# Altium schematic sheet Flomio BLE-NFC - RFID.SchDoc: Flomio BLE-NFC::RFID
size Tabloid; Author: Alex J. Tucker; CompanyName: Anidea Engineering, Inc.; DrawnBy: Alex J. Tucker; Engineer: Alex J. Tucker; Organization: Anidea Engineering, Inc.; Address1: 8020 Belvedere Rd.; Address2: Ste #1; Address3: West Palm Beach, FL; Address4: 33411    USA; DocumentNumber: 3; Revision: 3; SheetNumber: 3; SheetTotal: 5
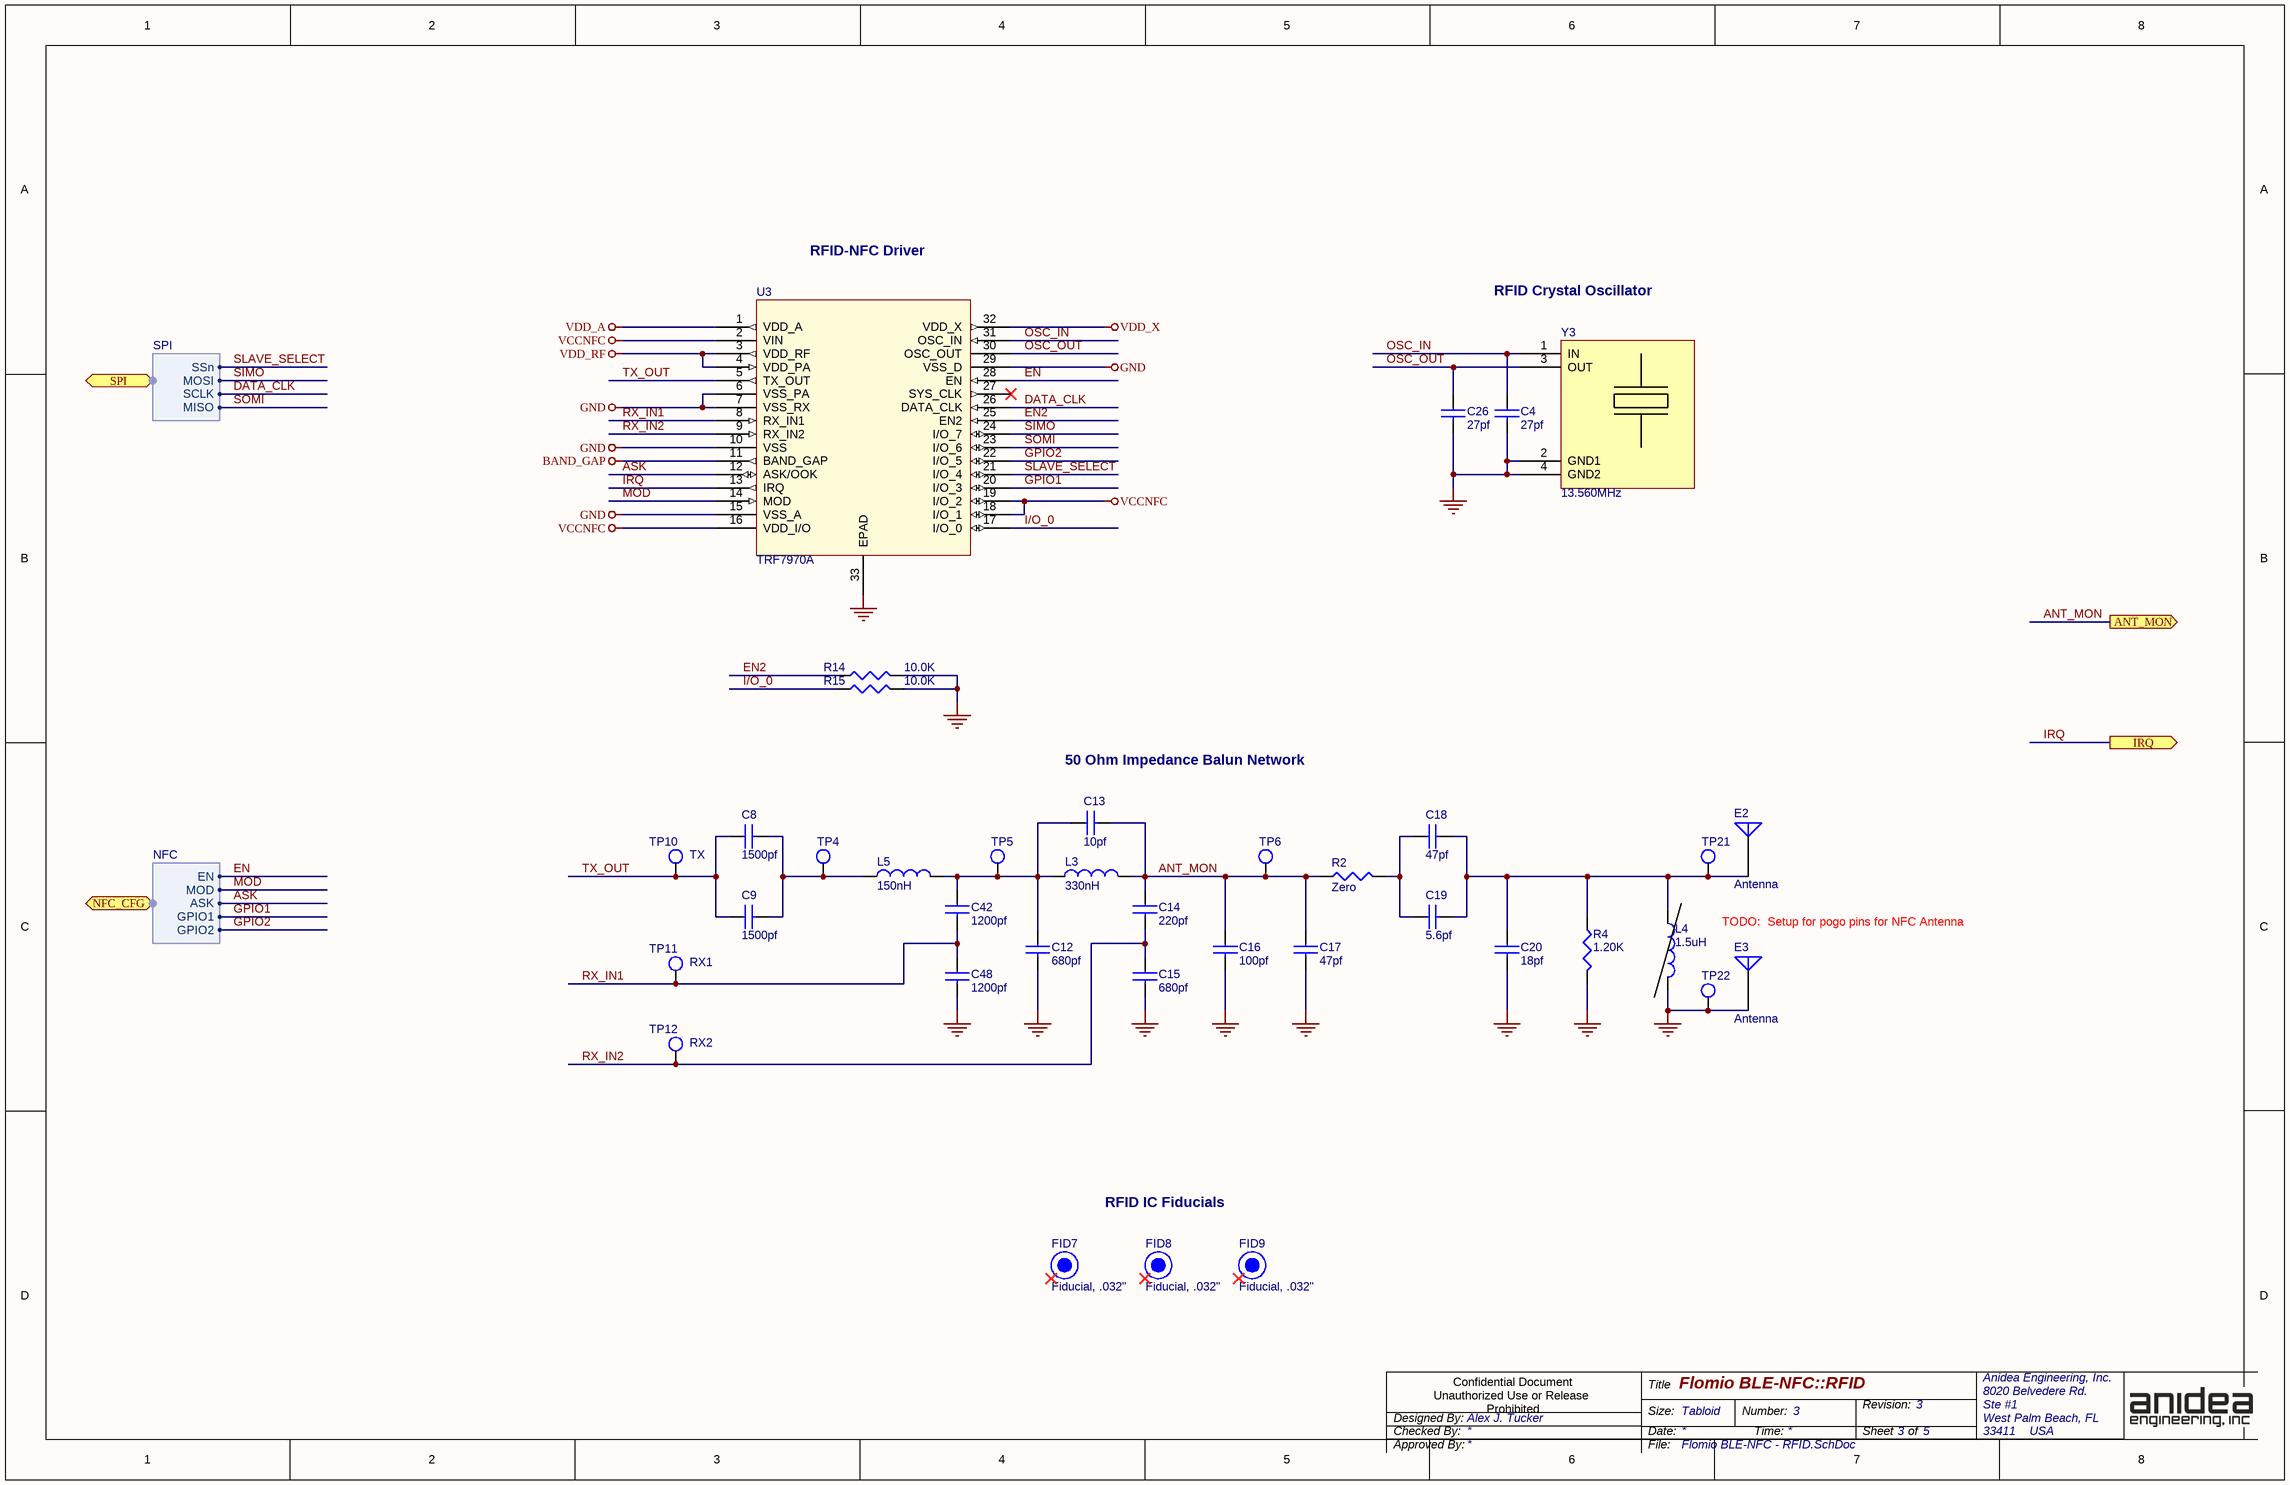
[diagram p0: Flomio BLE-NFC - RFID.SchDoc]

## Parts
C4  27pf  [SM/C_0603]
C8  1500pf  [SM/C_0603]
C9  1500pf  [SM/C_0603]
C12  680pf  [SM/C_0603]
C13  10pf  [SM/C_0603]
C14  220pf  [SM/C_0603]
C15  680pf  [SM/C_0603]
C16  100pf  [SM/C_0603]
C17  47pf  [SM/C_0603]
C18  47pf  [SM/C_0603]
C19  5.6pf  [SM/C_0603]
C20  18pf  [SM/C_0603]
C26  27pf  [SM/C_0603]
C42  1200pf  [SM/C_0603]
C48  1200pf  [SM/C_0603]
E2  Antenna  [CST/FLOMIO/ANT]
E3  Antenna  [CST/FLOMIO/ANT]
FID7  Fiducial, .032"  [FID32]  (no BOM)
FID8  Fiducial, .032"  [FID32]  (no BOM)
FID9  Fiducial, .032"  [FID32]  (no BOM)
L3  330nH  [SM/I_1008]
L4  1.5uH  [SM/I_0603]
L5  150nH  [SM/I_1008]
R2  Zero  [SM/R_0603]
R4  1.20K  [SM/R_0603]
R14  10.0K  [SM/R_0603]
R15  10.0K  [SM/R_0603]
TP4  TP  [VIA18]  (value not drawn)  (no BOM)
TP5  TP  [VIA18]  (value not drawn)  (no BOM)
TP6  TP  [VIA18]  (value not drawn)  (no BOM)
TP10  TX  [VIA18]  (no BOM)
TP11  RX1  [VIA18]  (no BOM)
TP12  RX2  [VIA18]  (no BOM)
TP21  TP  [VIA28]  (value not drawn)  (no BOM)
TP22  TP  [VIA28]  (value not drawn)  (no BOM)
U3  TRF7970A  [QFN50P500X500X100-32N]
Y3  13.560MHz  [CRYSTAL/ABM8G]

## Ports
ANT_MON (out), IRQ (out), NFC_CFG (harness NFC), SPI (harness SPI)

## Harnesses
SPI: SSn, MOSI, SCLK, MISO
NFC: EN, MOD, ASK, GPIO1, GPIO2

## Nets
BAND_GAP: U3.11(BAND_GAP)
GND: C4.2 C12.2 C15.2 C16.2 C17.2 C20.2 C26.2 C48.2 E3.1 L4.2 R4.2 R14.2 R15.2 TP22.1(TP) U3.6(VSS_PA) U3.7(VSS_RX) U3.10(VSS) U3.15(VSS_A) U3.29(VSS_D) U3.33(EPAD) Y3.2(GND1) Y3.4(GND2)
VCCNFC: U3.2(VIN) U3.16(VDD_I/O) U3.18(I/O_1) U3.19(I/O_2)
VDD_A: U3.1(VDD_A)
VDD_RF: U3.3(VDD_RF) U3.4(VDD_PA)
VDD_X: U3.32(VDD_X)
ANT_MON: C13.2 C14.1 C16.1 C17.1 L3.2 R2.1 TP6.1(TP) ; port ANT_MON
ASK: U3.12(ASK/OOK) ; port NFC_CFG.ASK
DATA_CLK: U3.26(DATA_CLK) ; port SPI.SCLK
EN: U3.28(EN) ; port NFC_CFG.EN
EN2: R14.1 U3.25(EN2)
GPIO1: U3.20(I/O_3) ; port NFC_CFG.GPIO1
GPIO2: U3.22(I/O_5) ; port NFC_CFG.GPIO2
I/O_0: R15.1 U3.17(I/O_0)
IRQ: U3.13(IRQ) ; port IRQ
MOD: U3.14(MOD) ; port NFC_CFG.MOD
OSC_IN: C4.1 U3.31(OSC_IN) Y3.1(IN)
OSC_OUT: C26.1 U3.30(OSC_OUT) Y3.3(OUT)
RX_IN1: C42.2 C48.1 TP11.1(TP) U3.8(RX_IN1)
RX_IN2: C14.2 C15.1 TP12.1(TP) U3.9(RX_IN2)
SIMO: U3.24(I/O_7) ; port SPI.MOSI
SLAVE_SELECT: U3.21(I/O_4) ; port SPI.SSn
SOMI: U3.23(I/O_6) ; port SPI.MISO
TX_OUT: C8.1 C9.1 TP10.1(TP) U3.5(TX_OUT)
NetC8_2: C8.2 C9.2 L5.1 TP4.1(TP)
NetC12_1: C12.1 C13.1 C42.1 L3.1 L5.2 TP5.1(TP)
NetC18_1: C18.1 C19.1 R2.2
NetC18_2: C18.2 C19.2 C20.1 E2.1 L4.1 R4.1 TP21.1(TP)

Not connected (* = marked no-connect by the designer): FID7 1*; FID8 1*; FID9 1*; U3 27(SYS_CLK)*

## Notes on the sheet
- RFID-NFC Driver
- RFID Crystal Oscillator
- 50 Ohm Impedance Balun Network
- TODO:  Setup for pogo pins for NFC Antenna
- RFID IC Fiducials
- Confidential Document
  Unauthorized Use or Release
  Prohibited
- Checked By:
- Designed By:
- Title
- Size:
- Date:
- Tabloid
- Number:
- Time:
- Revision:
- Sheet
- of
- Approved By:
- File:

## Library data of the parts
C4 C26 = C0603C270J5GACTU: Cap, 0603, 27pf , 50V, 5%, C0G, NP0; Mfg: Kemet; Part Number: C0603C270J5GACTU; Tolerance: 5%; Voltage: 50V; Mfg Part Number: C0603C270J5GACTU; ComponentLink1Description: Local; ComponentLink1URL: \\brak\public\pdf\Kemet Ceramic C0G.pdf; ComponentLink2Description: Web; Supplier Part Number 1: 399-1054-1-ND; Supplier 1: Digi-Key; RoHS: True; Rating: C0G, NP0; ComponentLink2URL: http://www.kemet.com/kemet/web/homepage/kechome.nsf/vapubfiles/KEM_C1003_C0G_SMD.pdf/$file/KEM_C1003_C0G_SMD.pdf
C8 C9 = CC0603KRX7R9BB152: Cap, 0603, 1500pf, 50V, 10%, X7R; Mfg: Yageo; Part Number: CC0603KRX7R9BB152; Tolerance: 10%; Voltage: 50V; Mfg Part Number: CC0603KRX7R9BB152; ComponentLink1Description: Local; ComponentLink1URL: \\brak\public\pdf\Yageo SMT Cap class 2 x7r.pdf; ComponentLink2Description: Web; RoHS: True; Rating: X7R; ComponentLink2URL: http://www.yageo.com/documents/recent/UPY-GPHC_X7R_6.3V-to-50V_8.pdf; Supplier Part Number 1: 311-1184-1-ND; Supplier 1: Digi-Key
C12 C15 = C0603C681K5RACTU: Cap, 0603, 680pf , 50V, 10%, X7R; Mfg: Kemet; Part Number: C0603C681K5RACTU; Tolerance: 10%; Voltage: 50V; Mfg Part Number: C0603C681K5RACTU; ComponentLink1Description: Local; ComponentLink1URL: \\brak\public\pdf\Kemet Ceramic X7R.pdf; ComponentLink2Description: Web; ComponentLink2URL: http://www.kemet.com/kemet/web/homepage/kechome.nsf/vapubfiles/KEM_C1002_X7R_SMD.pdf/$file/KEM_C1002_X7R_SMD.pdf; Supplier Part Number 1: 399-1077-1-ND; Supplier 1: Digi-Key; RoHS: True; Rating: X7R
C13 = 06035A100JAT2A: Cap, 0603, 10pf, 50V, 5%, C0G, NP0; Mfg: AVX; Part Number: 06035A100JAT2A; Tolerance: 5%; Voltage: 50V; Mfg Part Number: 06035A100JAT2A; ComponentLink1Description: Local; ComponentLink1URL: \\brak\public\pdf\AVX C0G.pdf; ComponentLink2Description: Web; Supplier Part Number 1: 478-1163-1-ND; Supplier 1: Digi-Key; RoHS: True; Rating: C0G, NP0; ComponentLink2URL: http://www.avx.com/docs/Catalogs/ccog.pdf
C14 = CC0603KRX7R9BB221: Cap, 0603, 220pf, 50V, 10%, X7R; Mfg: Yageo; Part Number: CC0603KRX7R9BB221; Tolerance: 10%; Voltage: 50V; Mfg Part Number: CC0603KRX7R9BB221; ComponentLink1Description: Local; ComponentLink1URL: \\brak\public\pdf\Yageo SMT Cap class 2 x7r.pdf; ComponentLink2Description: Web; Supplier Part Number 1: 311-1077-1-ND; Supplier 1: Digi-Key; RoHS: True; Rating: X7R; ComponentLink2URL: http://www.yageo.com/documents/recent/UPY-GPHC_X7R_6.3V-to-50V_8.pdf
C16 = 06035A101JAT2A: Cap, 0603, 100pf, 50V, 5%, C0G, NP0; Mfg: AVX; Part Number: 06035A101JAT2A; Tolerance: 5%; Voltage: 50V; Mfg Part Number: 06035A101JAT2A; ComponentLink1Description: Local; ComponentLink1URL: \\brak\public\pdf\AVX C0G.pdf; ComponentLink2Description: Web; Supplier Part Number 1: 478-1175-1-ND; Supplier 1: Digi-Key; RoHS: True; Rating: C0G, NP0; ComponentLink2URL: http://www.avx.com/docs/Catalogs/ccog.pdf
C17 = 06031A470JAT2A: Cap, 0603, 47pf, 100V, 5%, C0G, NP0; Mfg: AVX; Part Number: 06031A470JAT2A; Tolerance: 5%; Voltage: 100V; Mfg Part Number: 06031A470JAT2A; ComponentLink1Description: Local; ComponentLink1URL: \\brak\public\pdf\AVX C0G.pdf; ComponentLink2Description: Web; Supplier Part Number 1: 478-1144-1-ND; Supplier 1: Digi-Key; RoHS: True; Rating: C0G, NP0; ComponentLink2URL: http://www.avx.com/docs/Catalogs/ccog.pdf
C18 = GRM1885CD1H470JA01D: Cap, 0603, 47pf , 50V, 5%, C0G, NP0; Mfg Part Number: GRM1885C1H470JA01D; Mfg: Murata; Part Number: GRM1885CD1H470JA01D; Rating: C0G, NP0; Tolerance: 5%; Voltage: 50V; ComponentLink1Description: Local; ComponentLink1URL: \\newbrak\public\pdf\Murata Cap PN.pdf; ComponentLink2Description: Web; Supplier Part Number 1: 490-1419-1-ND; Supplier 1: Digi-Key; RoHS: True
C19 = GRM1885C1H5R6DZ01D: Cap, 0603, 5.6pf, 50V, ±0.5pF; Mfg: Murata; Part Number: GRM1885C1H5R6DZ01D; Tolerance: ±0.5pF; Voltage: 50V; Mfg Part Number: GRM1885C1H5R6DZ01D; ComponentLink1Description: Local; ComponentLink1URL: \\newbrak\public\pdf\Murata Cap PN.pdf; ComponentLink2Description: Web; Supplier Part Number 1: 490-1392-1-ND; Supplier 1: Digi-Key; RoHS: True
C20 = GCM1885C1H180JA16: Cap, 0603, 18pf, 50V, 5%, C0G, NP0; Mfg Part Number: GCM1885C1H180JA16D; Mfg: Murata; Part Number: GCM1885C1H180JA16; Tolerance: 5%; Voltage: 50V; ComponentLink1Description: Local; ComponentLink1URL: \\newbrak\public\pdf\Murata Cap PN.pdf; ComponentLink2Description: Web; Supplier Part Number 1: 490-6046-1-ND; Supplier 1: Digi-Key; RoHS: True; Rating: C0G, NP0; ComponentLink2URL: http://search.murata.co.jp/Ceramy/image/img/w_hinm/L0005E.pdf
C42 C48 = GRM1885C1H122JA01: Cap, 0603, 1200pf, 50V, 5%, C0G, NP0; Mfg Part Number: GRM1885C1H122JA01D; Mfg: Murata; Part Number: GRM1885C1H122JA01; Rating: C0G, NP0; Tolerance: 5%; Voltage: 50V; ComponentLink1Description: Local; ComponentLink1URL: \\newbrak\public\pdf\Murata Cap PN.pdf; ComponentLink2Description: Web; Supplier Part Number 1: 490-1453-1-ND; Supplier 1: Digi-Key; RoHS: True
E2 E3 = Flomio Antenna: Antenna, No part; Part Number: Flomio Antenna; ComponentLink1Description: Local; ComponentLink2Description: Web; RoHS: True
FID7-FID9 = FID32: Fiducual, .032" Pad; Obsolete: False; Part Number: FID32; ComponentLink1Description: Local; ComponentLink1URL: \\brak\public\pdf\; ComponentLink2Description: Web; RoHS: False; Part Type: Misc\Fiducual
L3 = PM1008-R33K-RC: Inductor, 1008, 330nH, 0.33uH, 500mA, SRF 570MHz, SMT, 10%; Mfg: Bourns; Part Number: PM1008-R33K-RC; Mfg Part Number: PM1008-R33K-RC; ComponentLink1Description: Local; ComponentLink1URL: \\brak\public\pdf\Bournes PM1008 Series.pdf; ComponentLink2Description: Web; ComponentLink2URL: http://www.bourns.com/data/global/pdfs/pm1008_series.pdf; Supplier Part Number 1: M8472CT-ND; Supplier 1: Digi-Key; RoHS: True; Rating: 500mA; Tolerance: 10%
L4 = MLF1608A1R5K: Inductor, 0603, 1.5uH, 50mA, 10MHz, SMT, 0603, 10%; Mfg: TDK; Part Number: MLF1608A1R5K; Tolerance: 10%; Mfg Part Number: MLF1608A1R5K; ComponentLink1Description: Local; ComponentLink1URL: \\brak\public\pdf\TDK e511_mlf_02 Inductors.pdf; ComponentLink2Description: Web; ComponentLink2URL: http://www.yuden.co.jp/productdata/catalog/en/mlci04_e.pdf; Supplier Part Number 1: 445-1015-1-ND; Supplier 1: Digi-Key; RoHS: True
L5 = LQW2UASR15J00L: Inductor, 1008, 150nH, 580mA, SRF 850MHz, SMT, 5%; Mfg: Murata; Part Number: LQW2UASR15J00L; Rating: 580mA; Tolerance: 5%; Mfg Part Number: LQW2UASR15J00L; ComponentLink1Description: Local; ComponentLink1URL: \\newbrak\public\pdf\Murata LQW2UA Chip Inductors.pdf; ComponentLink2Description: Web; ComponentLink2URL: http://search.murata.co.jp/Ceramy/image/img/PDF/ENG/L0075S0080LQW2UA.pdf; Supplier Part Number 1: 490-5693-1-ND; Supplier 1: Digi-Key; Supplier 2: Mouser; Supplier Part Number 2: 81-LQW2UASR15J00L; Supplier 3: Digi-Key; Supplier Part Number 3: 535-10541-1-ND; RoHS: True
R2 = ERJ-3GEY0R00V: Resistor, 0603, Zero Ohm; Rating: 1/10W; Mfg: Panasonic; Part Number: ERJ-3GEY0R00V; Mfg Part Number: ERJ-3GEY0R00V; ComponentLink1Description: Local; ComponentLink1URL: \\brak\public\pdf\Panasonic AOA0000CE1 Chip Res.pdf; ComponentLink2Description: Web; Supplier Part Number 1: P0.0GCT-ND; Supplier 1: Digi-Key; RoHS: True; ComponentLink2URL: http://industrial.panasonic.com/www-data/pdf/AOA0000/AOA0000CE1.pdf
R4 = CRCW06031K20FKEA: Resistor, 0603, 1.20K Ohm 1%; Rating: 1/10W; Mfg: Vishay; Part Number: CRCW06031K20FKEA; Tolerance: 1%; Mfg Part Number: CRCW06031K20FKEA; ComponentLink1Description: Local; ComponentLink1URL: \\newbrak\public\pdf\Vishay CRCW Resistors.pdf; ComponentLink2Description: Web; ComponentLink2URL: http://www.vishay.com/docs/20035/dcrcwe3.pdf; Supplier Part Number 1: 541-1.20KHCT-ND; Supplier 1: Digi-Key; RoHS: True
R14 R15 = CRCW060310K0F: Resistor, 0603, 10.0K Ohm 1%; Mfg Part Number: CRCW060310K0FKEA; Rating: 1/10W; Mfg: Vishay; Part Number: CRCW060310K0F; Tolerance: 1%; ComponentLink1Description: Local; ComponentLink1URL: \\brak\public\pdf\Vishay CRCW Resistors.pdf; ComponentLink2Description: Web; ComponentLink2URL: http://www.vishay.com/doc?20035; Supplier Part Number 1: 541-10.0KHCT-ND; Supplier 1: Digi-Key; Supplier 2: Yageo; Supplier Part Number 2: RC0603FR-0710KL; Supplier 3: Digi-Key; Supplier Part Number 3: 311-10.0KHRCT-ND; RoHS: True
TP4-TP6 TP10-TP12 = TP18: Testpoint, 18mil Hole, No part, just via; Part Number: TP18; ComponentLink1Description: Local; ComponentLink2Description: Web; RoHS: False
TP21 TP22 = TP28: Testpoint, 28mil Hole, No part, just via; Part Number: TP28; ComponentLink1Description: Local; ComponentLink2Description: Web; RoHS: False
U3 = TRF7970ARHBR: RFID/NFC Transceiver, 13.56MHz, 32QFN; Mfg: TI; Part Number: TRF7970ARHBR; Mfg Part Number: TRF7970ARHBR; ComponentLink1Description: Local; ComponentLink1URL: \\newbrak\public\pdf\TI TRF7970A RFID-NFC.pdf; ComponentLink2Description: Web; ComponentLink2URL: http://www.ti.com/lit/ds/symlink/trf7970a.pdf; Supplier Part Number 1: 296-29355-1-ND; Supplier 1: Digi-Key; RoHS: True
Y3 = ABM8G-13.560MHZ-18-D2Y-T: Crystal, SMT, 13.560MHz, 18pF; Tolerance: ±20ppm; Mfg: Abracon; Part Number: ABM8G-13.560MHZ-18-D2Y-T; Mfg Part Number: ABM8G-13.560MHZ-18-D2Y-T; ComponentLink1Description: Local; ComponentLink1URL: \\newbrak\public\pdf\Abracon ABM8G.pdf; ComponentLink2Description: Web; ComponentLink2URL: http://www.abracon.com/Resonators/ABM8G.pdf; Supplier Part Number 1: 535-10264-1-ND; Supplier 1: Digi-Key; RoHS: True